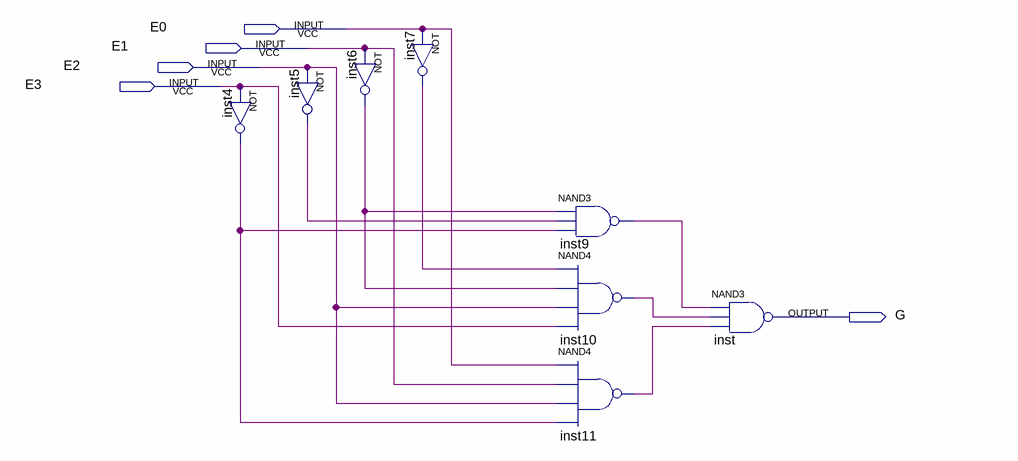
[diagram p0: schematic sheet]
// Quartus schematic G.bdf as structural Verilog: 8 symbols, 5 pins
module G (
  input  E0,
  input  E1,
  input  E2,
  input  E3,
  output G
);

  wire inst4_out, inst5_out, inst6_out, inst7_out, inst9_out, inst10_out, inst11_out;

  not inst4 (inst4_out, E3);
  not inst6 (inst6_out, E1);
  not inst5 (inst5_out, E2);
  not inst7 (inst7_out, E0);
  nand inst9 (inst9_out, inst6_out, inst5_out, inst4_out);
  nand inst10 (inst10_out, inst7_out, inst6_out, E2, E3);
  nand inst11 (inst11_out, E0, E1, E2, inst4_out);
  nand inst (G, inst9_out, inst10_out, inst11_out);
endmodule
